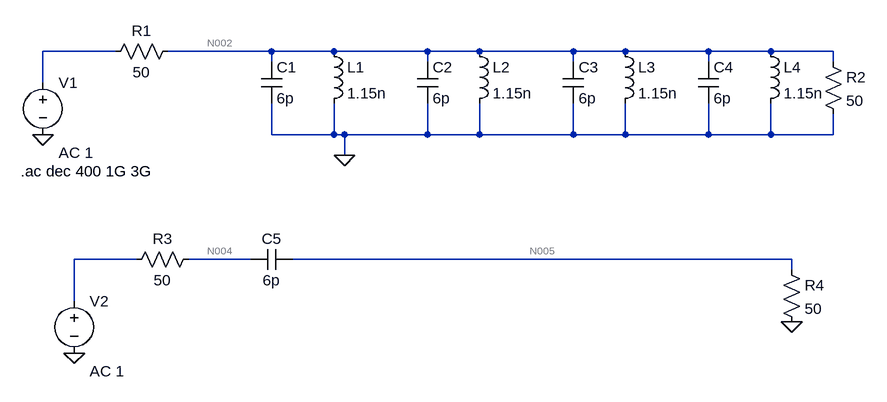
[diagram p0: schematic Draft9.asc]
Draft9.asc, the LTspice schematic file:
Version 4
SHEET 1 1016 748
WIRE -144 240 -256 240
WIRE 96 240 -64 240
WIRE 192 240 96 240
WIRE 336 240 192 240
WIRE 416 240 336 240
WIRE 560 240 416 240
WIRE 640 240 560 240
WIRE 768 240 640 240
WIRE 864 240 768 240
WIRE 960 240 864 240
WIRE 96 256 96 240
WIRE 336 256 336 240
WIRE 560 256 560 240
WIRE 768 256 768 240
WIRE 960 256 960 240
WIRE -256 288 -256 240
WIRE 96 368 96 320
WIRE 192 368 192 320
WIRE 192 368 96 368
WIRE 208 368 192 368
WIRE 336 368 336 320
WIRE 336 368 208 368
WIRE 416 368 416 320
WIRE 416 368 336 368
WIRE 560 368 560 320
WIRE 560 368 416 368
WIRE 640 368 640 320
WIRE 640 368 560 368
WIRE 768 368 768 320
WIRE 768 368 640 368
WIRE 864 368 864 320
WIRE 864 368 768 368
WIRE 960 368 960 336
WIRE 960 368 864 368
WIRE 208 400 208 368
WIRE -112 560 -208 560
WIRE 64 560 -32 560
WIRE 896 560 128 560
WIRE 896 576 896 560
WIRE -208 624 -208 560
FLAG 208 400 0
FLAG -256 368 0
FLAG 896 656 0
FLAG -208 704 0
SYMBOL res -48 224 R90
WINDOW 0 0 56 VBottom 2
WINDOW 3 32 56 VTop 2
SYMATTR InstName R1
SYMATTR Value 50
SYMBOL cap 80 256 R0
SYMATTR InstName C1
SYMATTR Value 6p
SYMBOL ind 176 224 R0
SYMATTR InstName L1
SYMATTR Value 1.15n
SYMBOL voltage -256 272 R0
WINDOW 123 24 124 Left 2
WINDOW 39 0 0 Left 0
SYMATTR InstName V1
SYMATTR Value ""
SYMATTR Value2 AC 1
SYMBOL cap 320 256 R0
SYMATTR InstName C2
SYMATTR Value 6p
SYMBOL ind 400 224 R0
SYMATTR InstName L2
SYMATTR Value 1.15n
SYMBOL cap 544 256 R0
SYMATTR InstName C3
SYMATTR Value 6p
SYMBOL ind 624 224 R0
SYMATTR InstName L3
SYMATTR Value 1.15n
SYMBOL cap 752 256 R0
SYMATTR InstName C4
SYMATTR Value 6p
SYMBOL ind 848 224 R0
SYMATTR InstName L4
SYMATTR Value 1.15n
SYMBOL res 944 240 R0
SYMATTR InstName R2
SYMATTR Value 50
SYMBOL cap 128 544 R90
WINDOW 0 0 32 VBottom 2
WINDOW 3 32 32 VTop 2
SYMATTR InstName C5
SYMATTR Value 6p
SYMBOL res -16 544 R90
WINDOW 0 0 56 VBottom 2
WINDOW 3 32 56 VTop 2
SYMATTR InstName R3
SYMATTR Value 50
SYMBOL res 880 560 R0
SYMATTR InstName R4
SYMATTR Value 50
SYMBOL voltage -208 608 R0
WINDOW 123 24 124 Left 2
WINDOW 39 0 0 Left 0
SYMATTR InstName V2
SYMATTR Value ""
SYMATTR Value2 AC 1
TEXT -290 424 Left 2 !.ac dec 400 1G 3G

The netlist it stands for:
* Draft9.asc
R1 N002 N001 50
C1 N002 0 6p
L1 N002 0 1.15n
V1 N001 0 AC 1
C2 N002 0 6p
L2 N002 0 1.15n
C3 N002 0 6p
L3 N002 0 1.15n
C4 N002 0 6p
L4 N002 0 1.15n
R2 N002 0 50
C5 N005 N004 6p
R3 N004 N003 50
R4 N005 0 50
V2 N003 0 AC 1
.ac dec 400 1G 3G
.backanno
.end

* Results of the author's LTspice run, read from the files saved beside the schematic
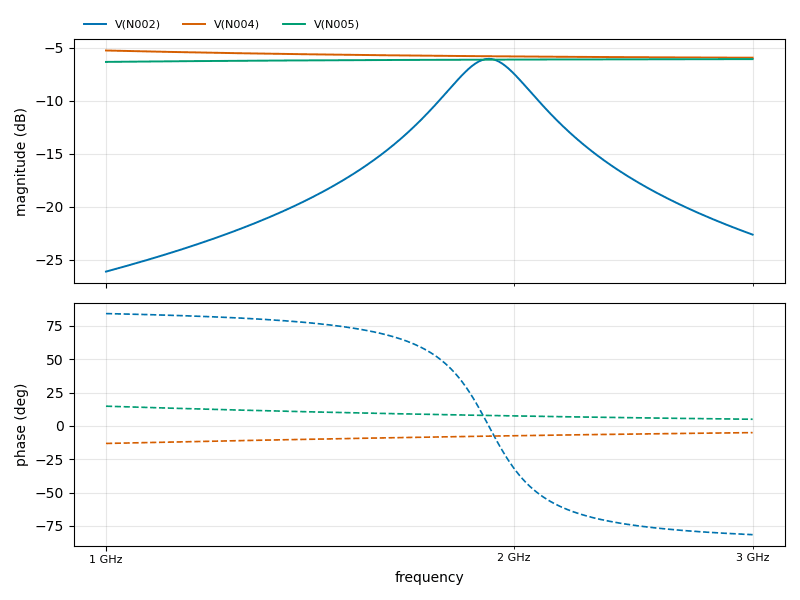
[diagram p1: AC Analysis of Draft9.asc, plotted from the saved traces]
* AC Analysis, 1 run:
*   V(N002): -26.12 dB at 1 GHz, -22.63 dB at 3 GHz, peak -6.03 dB at 1.916 GHz, 3 dB below the peak at 1.788 GHz and 2.053 GHz
*   V(N004): -5.24 dB at 1 GHz, -5.92 dB at 3 GHz, peak -5.24 dB at 1 GHz
*   V(N005): -6.32 dB at 1 GHz, -6.05 dB at 3 GHz, peak -6.05 dB at 3 GHz